# Altium project BB8_BMS.PrjPcb (part 2 of 2)

## Sheet USB_UART.SchDoc
size A
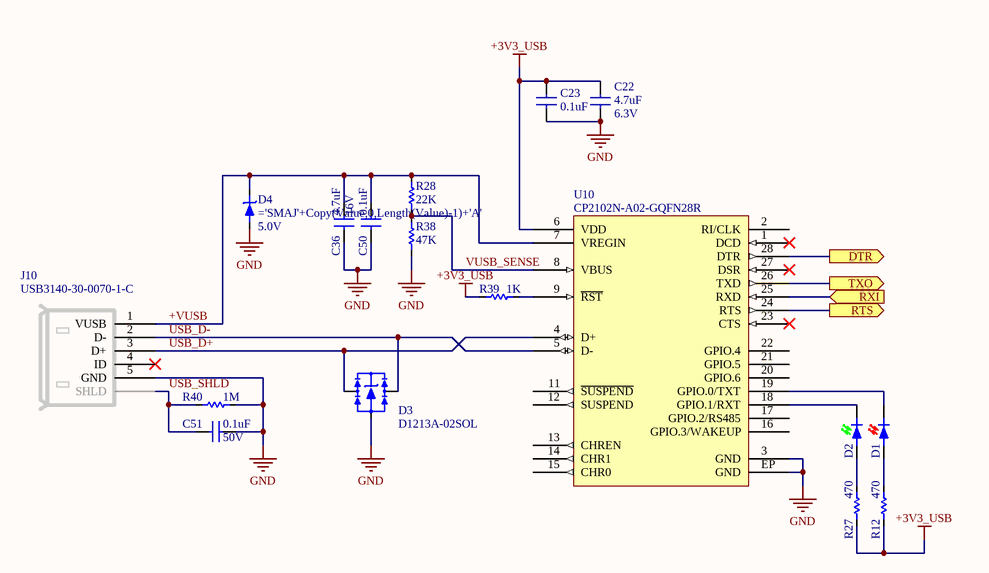
[diagram p11: USB_UART.SchDoc]

### Parts
C22  value 4.7uF  Voltage: 6.3V  [0603_Capacitor]  (hidden comment: CAP 4.7uF 6.3V X5R)
C23  value 0.1uF  [0402_CAPACITOR]  (hidden comment: CAP 0.1uF 16V X7R)
C36  value 4.7uF  Voltage: 16V  [0805_Capacitor]  (hidden comment: CAP 4.7uF 16V X5R)
C50  value 0.1uF  [0402_CAPACITOR]  (hidden comment: CAP 0.1uF 16V X7R)
C51  value 0.1uF  Voltage: 50V  [0603_CAPACITOR]  (hidden comment: CAP 0.1uF 50V X7R)
D1  LTST-C194KRKT  [0603_LED_Red]  (value not drawn)
D2  LTST-C194KGKT  [0603_LED_Green]  (value not drawn)
D3  D1213A-02SOL  [SOT23-3]
D4  value 5.0V  [SMA]  (hidden comment: TVS Diode)
J10  USB3140-30-0070-1-C  [J_USB3140-30-0070-1-C]
R12  value 470  [0402_Resistor]  (hidden comment: R_0402_470_1%)
R27  value 470  [0402_Resistor]  (hidden comment: R_0402_470_1%)
R28  value 22K  [0402_Resistor]  (hidden comment: R_0402_22K_1%)
R38  value 47K  [0402_Resistor]  (hidden comment: R_0402_47K_1%)
R39  value 1K  [0402_Resistor]  (hidden comment: R_0402_1K_1%)
R40  value 1M  [0603_Resistor]  (hidden comment: R_0603_1M_1%)
U10  CP2102N-A02-GQFN28R  [QFN-28-EP_5x5mm]

### Ports
DTR (out), RTS (out), RXI (in), TXO (out)

### Nets
+3V3_USB: C22.2 C23.1 R12.2 R27.2 R39.1 U10.6(VDD)
GND: C22.1 C23.2 C36.1 C50.2 C51.1 D3.3 D4.1(Anode) J10.5(GND) R38.1 R40.2 U10.3(GND) U10.EP(GND)
+VUSB: C36.2 C50.1 D4.2(Cathode) J10.1(VUSB) R28.2 U10.7(VREGIN)
DTR: U10.28(DTR) ; port DTR
RTS: U10.24(RTS) ; port RTS
RXI: U10.25(RXD) ; port RXI
TXO: U10.26(TXD) ; port TXO
USB_D+: D3.1 J10.3(D+) U10.4(D+)
USB_D-: D3.2 J10.2(D-) U10.5(D-)
USB_SHLD: C51.2 J10.SHLD R40.1
VUSB_SENSE: R28.1 R38.2 U10.8(VBUS)
NetD1_1: D1.1(Anode) R12.1
NetD1_2: D1.2(Cathode) U10.19(GPIO.0/TXT)
NetD2_1: D2.1(Anode) R27.1
NetD2_2: D2.2(Cathode) U10.18(GPIO.1/RXT)
NetR39_2: R39.2 U10.9(~{RST})

Not connected (* = marked no-connect by the designer): J10 4(ID)*; U10 1(DCD)* 2(RI/CLK) 11(~{SUSPEND}) 12(SUSPEND) 13(CHREN) 14(CHR1) 15(CHR0) 16(GPIO.3/WAKEUP) 17(GPIO.2/RS485) 20(GPIO.6) 21(GPIO.5) 22(GPIO.4) 23(CTS)* 27(DSR)*

### Library data of the parts
C22 = C_0603_4.7uF_6.3V_10%: CAP CER 4.7UF 6.3V X5R 0603; Package: =SelectedPackage; Temperature Coefficient: X5R; Supplier 1: Digi-Key; Supplier Part Number 1: 1276-1045-1-ND
C23 C50 = C_0402_0.1uF_16V_10%: CAP CERM 0.1uF 10% 16V 0402; Package: =SelectedPackage; Voltage: 16V; Temperature Coefficient: X7R; Supplier 1: Digi-Key; Supplier Part Number 1: 1276-1001-1-ND; Supplier 2: Digi-Key; Supplier Part Number 2: 587-1451-1-ND
C36 = C_0805_4.7uF_16V_10%: CAP CERM 4.7uF 10% 16V 0805; SVP Creator: Spencer Berglund; Package: =SelectedPackage; Temperature Coefficient: X5R; Supplier 1: Digi-Key; Supplier Part Number 1: 1276-1065-6-ND
C51 = C_0603_0.1uF_50V_10%: CAP CERM 0.1uF 10% 50V 0603; SVP Creator: Spencer Berglund; Package: =SelectedPackage; Temperature Coefficient: X7R; Supplier 1: Digi-Key; Supplier Part Number 1: 1276-1000-1-ND
D1 = D_LED_0603_Red: Red 631nm LED Indication - Discrete 2V 0603 (1608 Metric); Manufacturer: Vishay Lite-On; Lens Transparency: Clear; Lens Colour: Colorless; Reverse Voltage: 5V; Forward Current: 5mA; Power Dissipation: 75mW; Luminous Intensity: 95.6mcd; Test Current: 20mA; Viewing Angle: 130°; Value: Red; Manufacturer Part Number: LTST-C194KRKT; Min Operating Temperature: -30°C; Forward Voltage: 2V; Max Operating Temperature: 85°C; Dominant Wavelength: 631nm; Supplier 1: Digi-Key; Supplier Part Number 1: 160-1835-1-ND
D2 = D_LED_0603_Green: Green 572nm LED Indication - Discrete 2.1V 0603 (1608 Metric); Manufacturer: Vishay Lite-On; Lens Transparency: Clear; Lens Colour: Colorless; Reverse Voltage: 5V; Forward Current: 30mA; Power Dissipation: 75mW; Luminous Intensity: 112mcd; Forward Voltage: 2.4V; Test Current: 20mA; Viewing Angle: 130°; Dominant Wavelength: 576.5nm; Value: Green; Manufacturer Part Number: LTST-C194KGKT; Min Operating Temperature: -30°C; Max Operating Temperature: 85°C; Supplier 1: Digi-Key; Supplier Part Number 1: 160-1834-1-ND
D3 = D_D1213A-02SOL: 10V (Typ) Clamp 1A (8/20µs) Ipp Tvs Diode Surface Mount SOT-23 (for USB); Manufacturer: Diodes Incorporated; Type: Steering (Rail to Rail); Voltage - Breakdown (Min): 6V; Capacitance @ Frequency: 0.85pF @ 1MHz; Voltage - Reverse Standoff (Typ): 3.3V; Manufacturer Part Number: D1213A-02SOL; Voltage - Clamping (Max) @ Ipp: 10V (Typ); Current - Peak Pulse (10/1000µs): 1A (8/20µs); Operating Temperature: -40°C ~ 85°C (TA)
D4 = D_TVS_SMAJ_Uni_generic: SMA Unidirectional TVS Diode; Manufacturer: Vishay; Power - Peak Pulse: 400W; Type: Zener; Operating Temperature: -55°C ~ 150°C; HelpURL: http://www.vishay.com/docs/88392/smbj.pdf; Manufacturer PN: ='SMAJ'+Copy(Value,0,Length(Value)-1)+'A'
J10 = J_USB3140-30-0070-1-C: USB - micro B USB 2.0 Receptacle Connector 5 Position Surface Mount, Through Hole; Supplier 1: Digi-Key; Supplier Part Number 1: 2073-USB3140-30-0070-1-CCT-ND
R12 R27 R28 R38 R39 = R_0402_generic_1%: Generic 0402 Resistor (10.2R to 10M); Manufacturer: Yageo; Power Rating: 0.0625W; Temperature Coefficient: ±100ppm/°C; Tolerance: ±1%; Voltage Rating: 50V; Operating Temperature: -55°C ~ 155°C; Manufacturer Part Number: ='RC0402FR-07'+ValueFormatted+'L'; HelpURL: https://www.digikey.com/products/en/resistors/chip-resistor-surface-mount/52?pv17=103&FV=fffc000d%2Cc0001%2C1c0002%2C1f140000%2Cffe00034&k=RC0402; ValueFormatted: =Copy(Copy(Value, 0, Pos('.', Value)-1)+Copy(Value, Length(Value), 1)+Copy(Value, Pos('.', Value)+1, Length(Value)-Pos('.', Value)-1),1,Pos('.',Value)*Length(Value))+Copy(Value,1,Length(Value)*(1-Pos('.',Value)))
R40 = R_0603_generic_1%: Generic 0603 Resistor (10.2R to 10M); Manufacturer: Yageo; Power Rating: 0.1W; Temperature Coefficient: ±100ppm/°C; Tolerance: ±1%; Voltage Rating: 75V; Operating Temperature: -55°C ~ 155°C; Manufacturer Part Number: ='RC0603FR-07'+ValueFormatted+'L'; HelpURL: https://www.digikey.com/products/en/resistors/chip-resistor-surface-mount/52?pv17=103&FV=fffc000d%2Cc0001%2C1c0002%2C1f140000%2Cffe00034&k=RC0603; ValueFormatted: =Copy(Copy(Value, 0, Pos('.', Value)-1)+Copy(Value, Length(Value), 1)+Copy(Value, Pos('.', Value)+1, Length(Value)-Pos('.', Value)-1),1,Pos('.',Value)*Length(Value))+Copy(Value,1,Length(Value)*(1-Pos('.',Value)))
U10 = U_CP2102N-A02-GQFN28R: USB Bridge, USB to UART USB 2.0 UART Interface 28-QFN (5x5); Supplier 1: Digi-Key; Supplier 2: Mouser; Supplier Part Number 1: 336-5890-1-ND; Supplier Part Number 2: 634-CP2102NA02QFN28R

## Sheet CAN.SchDoc
size A
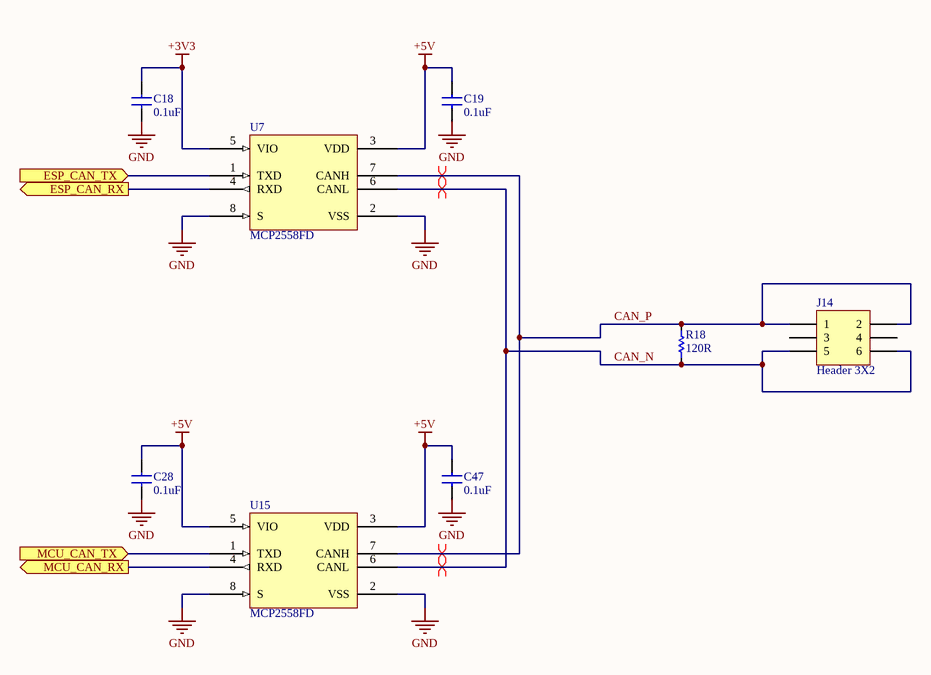
[diagram p12: CAN.SchDoc]

### Parts
C18  value 0.1uF  [0402_CAPACITOR]  (hidden comment: CAP 0.1uF 16V X7R)
C19  value 0.1uF  [0402_CAPACITOR]  (hidden comment: CAP 0.1uF 16V X7R)
C28  value 0.1uF  [0402_CAPACITOR]  (hidden comment: CAP 0.1uF 16V X7R)
C47  value 0.1uF  [0402_CAPACITOR]  (hidden comment: CAP 0.1uF 16V X7R)
J14  Header 3X2  [HDR2X3]
R18  value 120R  [0805_Resistor]  (hidden comment: R_0805_120R_1%)
U7  MCP2558FD  [SOIC-8]
U15  MCP2558FD  [SOIC-8]

### Ports
ESP_CAN_RX (out), ESP_CAN_TX (in), MCU_CAN_RX (out), MCU_CAN_TX (in)

### Nets
+3V3: C18.2 U7.5(VIO)
+5V: C19.2 C28.2 C47.2 U7.3(VDD) U15.3(VDD) U15.5(VIO)
GND: C18.1 C19.1 C28.1 C47.1 U7.2(VSS) U7.8(S) U15.2(VSS) U15.8(S)
CAN_N: J14.5 J14.6 R18.1 U7.6(CANL) U15.6(CANL)
CAN_P: J14.1 J14.2 R18.2 U7.7(CANH) U15.7(CANH)
ESP_CAN_RX: U7.4(RXD) ; port ESP_CAN_RX
ESP_CAN_TX: U7.1(TXD) ; port ESP_CAN_TX
MCU_CAN_RX: U15.4(RXD) ; port MCU_CAN_RX
MCU_CAN_TX: U15.1(TXD) ; port MCU_CAN_TX

Not connected (* = marked no-connect by the designer): J14 3 4

### Layout directives
differential pair: CAN_N, CAN_P

### Library data of the parts
C18 C19 C28 C47 = C_0402_0.1uF_16V_10%: CAP CERM 0.1uF 10% 16V 0402; Package: =SelectedPackage; Voltage: 16V; Temperature Coefficient: X7R; Supplier 1: Digi-Key; Supplier Part Number 1: 1276-1001-1-ND; Supplier 2: Digi-Key; Supplier Part Number 2: 587-1451-1-ND
J14 = Header 3X2: Header, 3-Pin, Dual row; LatestRevisionDate: 17-Jul-2002; LatestRevisionNote: Re-released for DXP Platform.; Publisher: Altium Limited
R18 = R_0805_generic_1%: Generic 0805 resistor (10.2R to 10M); Manufacturer: Yageo; Power Rating: 0.125W; Temperature Coefficient: ±100ppm/°C; Tolerance: ±1%; Voltage Rating: 150V; Operating Temperature: -55°C ~ 155°C; Manufacturer Part Number: ='RC0805FR-07'+ValueFormatted+'L'; HelpURL: https://www.digikey.com/products/en/resistors/chip-resistor-surface-mount/52?pv17=103&FV=fffc000d%2Cc0001%2C1c0002%2C1f140000%2Cffe00034&k=RC0805; ValueFormatted: =Copy(Copy(Value, 0, Pos('.', Value)-1)+Copy(Value, Length(Value), 1)+Copy(Value, Pos('.', Value)+1, Length(Value)-Pos('.', Value)-1),1,Pos('.',Value)*Length(Value))+Copy(Value,1,Length(Value)*(1-Pos('.',Value)))
U7 U15 = U_MCP2558FD: 1/1 Transceiver CANbus 8-SOIC; Manufacturer: Microchip; Manufacturer Part Number: MCP2558FD-H/SN; Receiver Hysteresis: 200mV; Supplier 1: Digi-Key; Supplier Part Number 1: MCP2558FD-H/SN-ND; Min Operating Temperature: -40°C; Max Operating Temperature: 150°C

## Sheet Audio.SchDoc
size A
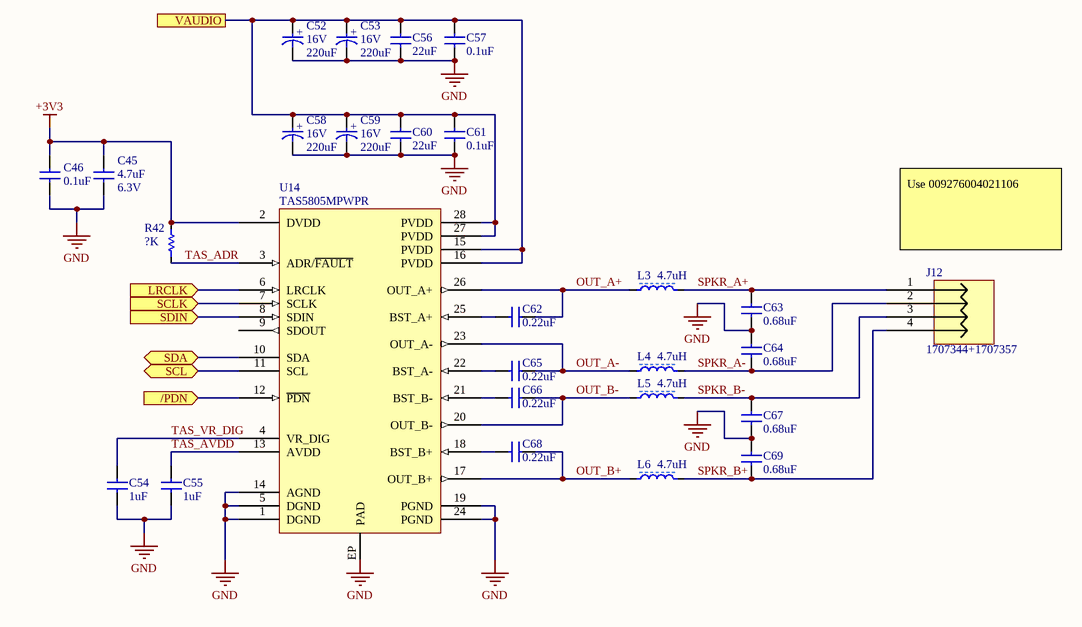
[diagram p13: Audio.SchDoc]

### Parts
C45  value 4.7uF  Voltage: 6.3V  [0603_Capacitor]  (hidden comment: CAP 4.7uF 6.3V X5R)
C46  value 0.1uF  [0402_CAPACITOR]  (hidden comment: CAP 0.1uF 16V X7R)
C52  value 220uF  Voltage Rating: 16V  [CAP_6.3x8mm_SMD]  (hidden comment: APXG160ARA221MF80G)
C53  value 220uF  Voltage Rating: 16V  [CAP_6.3x8mm_SMD]  (hidden comment: APXG160ARA221MF80G)
C54  value 1uF  [0603_CAPACITOR]  (hidden comment: CAP 1uF 16V X7R)
C55  value 1uF  [0603_CAPACITOR]  (hidden comment: CAP 1uF 16V X7R)
C56  value 22uF  [0805_Capacitor]  (hidden comment: CAP 22uF 16V X5R)
C57  value 0.1uF  [0603_CAPACITOR]  (hidden comment: CAP 0.1uF 50V X7R)
C58  value 220uF  Voltage Rating: 16V  [CAP_6.3x8mm_SMD]  (hidden comment: APXG160ARA221MF80G)
C59  value 220uF  Voltage Rating: 16V  [CAP_6.3x8mm_SMD]  (hidden comment: APXG160ARA221MF80G)
C60  value 22uF  [0805_Capacitor]  (hidden comment: CAP 22uF 16V X5R)
C61  value 0.1uF  [0603_CAPACITOR]  (hidden comment: CAP 0.1uF 50V X7R)
C62  value 0.22uF  [0603_CAPACITOR]  (hidden comment: CAP 0.22uF 25V X7R)
C63  value 0.68uF  [0805_Capacitor]  (hidden comment: CAP 0.68uF 25V X7R)
C64  value 0.68uF  [0805_Capacitor]  (hidden comment: CAP 0.68uF 25V X7R)
C65  value 0.22uF  [0603_CAPACITOR]  (hidden comment: CAP 0.22uF 25V X7R)
C66  value 0.22uF  [0603_CAPACITOR]  (hidden comment: CAP 0.22uF 25V X7R)
C67  value 0.68uF  [0805_Capacitor]  (hidden comment: CAP 0.68uF 25V X7R)
C68  value 0.22uF  [0603_CAPACITOR]  (hidden comment: CAP 0.22uF 25V X7R)
C69  value 0.68uF  [0805_Capacitor]  (hidden comment: CAP 0.68uF 25V X7R)
J12  1707344+1707357  [1707344(3)+1707357(1)]
L3  value 4.7uH  [L_SRN6045]  (hidden comment: SRN6045TA-4R7M)
L4  value 4.7uH  [L_SRN6045]  (hidden comment: SRN6045TA-4R7M)
L5  value 4.7uH  [L_SRN6045]  (hidden comment: SRN6045TA-4R7M)
L6  value 4.7uH  [L_SRN6045]  (hidden comment: SRN6045TA-4R7M)
R42  value ?K  [0402_Resistor]  (hidden comment: R_0402_?K_1%)
U14  TAS5805MPWPR  [TSSOP-28-EP]

### Ports
/PDN (in), LRCLK (in), SCL (bidir), SCLK (in), SDA (bidir), SDIN (in), VAUDIO

### Nets
+3V3: C45.2 C46.1 R42.2 U14.2(DVDD)
GND: C45.1 C46.2 C52.2 C53.2 C54.2 C55.2 C56.2 C57.2 C58.2 C59.2 C60.2 C61.2 C63.2 C64.1 C67.2 C69.1 U14.1(DGND) U14.5(DGND) U14.14(AGND) U14.19(PGND) U14.24(PGND) U14.EP(PAD)
/BOOT: U14.12(~{PDN}) ; port /PDN
I2S_LRCLK: U14.6(LRCLK) ; port LRCLK
I2S_SCLK: U14.7(SCLK) ; port SCLK
I2S_SDIN: U14.8(SDIN) ; port SDIN
OUT_A+: C62.1 L3.1 U14.26(OUT_A+)
OUT_A-: C65.1 L4.1 U14.23(OUT_A-)
OUT_B+: C68.1 L6.1 U14.17(OUT_B+)
OUT_B-: C66.1 L5.1 U14.20(OUT_B-)
PMON/IMU_SCL: U14.11(SCL) ; port SCL
PMON/IMU_SDA: U14.10(SDA) ; port SDA
SPKR_A+: C63.1 J12.1 L3.2
SPKR_A-: C64.2 J12.2 L4.2
SPKR_B+: C69.2 J12.4 L6.2
SPKR_B-: C67.1 J12.3 L5.2
TAS_ADR: R42.1 U14.3(ADR/~{FAULT})
TAS_AVDD: C55.1 U14.13(AVDD)
TAS_VR_DIG: C54.1 U14.4(VR_DIG)
VBUS: C52.1 C53.1 C56.1 C57.1 C58.1 C59.1 C60.1 C61.1 U14.15(PVDD) U14.16(PVDD) U14.27(PVDD) U14.28(PVDD) ; port VAUDIO
NetC62_2: C62.2 U14.25(BST_A+)
NetC65_2: C65.2 U14.22(BST_A-)
NetC66_2: C66.2 U14.21(BST_B-)
NetC68_2: C68.2 U14.18(BST_B+)

Not connected (* = marked no-connect by the designer): U14 9(SDOUT)

### Notes on the sheet
- (near J12) Use 009276004021106
- (in symbol C_APXG160ARA221MF80G) +

### Library data of the parts
C45 = C_0603_4.7uF_6.3V_10%: CAP CER 4.7UF 6.3V X5R 0603; Package: =SelectedPackage; Temperature Coefficient: X5R; Supplier 1: Digi-Key; Supplier Part Number 1: 1276-1045-1-ND
C46 = C_0402_0.1uF_16V_10%: CAP CERM 0.1uF 10% 16V 0402; Package: =SelectedPackage; Voltage: 16V; Temperature Coefficient: X7R; Supplier 1: Digi-Key; Supplier Part Number 1: 1276-1001-1-ND; Supplier 2: Digi-Key; Supplier Part Number 2: 587-1451-1-ND
C52 C53 C58 C59 = C_APXG160ARA221MF80G: 220µF 16V Aluminum Polymer Capacitor Radial, Can - SMD 22 mOhm 15000 Hrs @ 105°C; Manufacturer: United Chemi-Con; ESR (Equivalent Series Resistance): 22mR; Life (Hours): 15000Hour; Tolerance: 20%; Ripple Current: 3.3A; Supplier 1: Digi-Key; Supplier Part Number 1: 565-4283-6-ND; Manufacturer Part Number: APXG160ARA221MF80G; Min Operating Temperature: -55°C; Max Operating Temperature: 105°C
C54 C55 = C_0603_1uF_16V_10%: CAP CERM 1uF 10% 16V 0603; SVP Creator: Spencer Berglund; Package: =SelectedPackage; Voltage: 16V; Temperature Coefficient: X7R; Supplier 1: Digi-Key; Supplier Part Number 1: 1276-6524-6-ND
C56 C60 = C_0805_22uF_16V_20%: CAP CERM 22uF 20% 16V 0805; Package: =SelectedPackage; Voltage: 16V; Temperature Coefficient: X5R; Supplier 1: Digi-Key; Supplier Part Number 1: 1276-6780-6-ND
C57 C61 = C_0603_0.1uF_50V_10%: as C51 on sheet USB_UART; Package: =SelectedPackage; Voltage: 50V; Temperature Coefficient: X7R; Supplier 1: Digi-Key; Supplier Part Number 1: 1276-1000-1-ND
C62 C65 C66 C68 = C_0603_0.22uF_25V_10%: CAP CER 0.22UF 25V X7R 0603; Package: =SelectedPackage; Voltage: 25V; Temperature Coefficient: X7R; Supplier 1: Arrow; Supplier 2: Digi-Key; Supplier Part Number 1: CL10B224KA8NNNC; Supplier Part Number 2: 1276-1111-1-ND
C63 C64 C67 C69 = C_0805_0.68uF_25V_10%: CAP CERM 0.68uF 10% 25V 0805; Package: =SelectedPackage; Voltage: 25V; Temperature Coefficient: X7R; Supplier 1: Digi-Key; Supplier 2: Mouser; Supplier Part Number 1: 311-3386-1-ND; Supplier Part Number 2: 603-CC805KKX7R8BB684
J12 = J_PHOENIX_4T_3.81: PCB terminal block ZFKDS 3.81mm vertical, 4 pin; Supplier 1: Digi-Key; Supplier Part Number 1: 277-6731-ND; Supplier 2: Digi-Key; Supplier Part Number 2: 1707357-ND
L3-L6 = L_SRN6045TA-4R7M: 4.7µH Semi-Shielded Wirewound Inductor 4.5A 26mOhm Nonstandard; Manufacturer: Bourns; Inductance Tolerance: 20%; Saturation Current: 6.8A; DC Resistance (DCR): 26mR; RMS Current (Irms): 4.5A; Manufacturer Part Number: SRN6045TA-4R7M; Supplier 1: Digi-Key; Supplier Part Number 1: SRN6045TA-4R7MCT-ND
R42 = R_0402_generic_1%: as R12 on sheet USB_UART; Operating Temperature: -55°C ~ 155°C; Manufacturer Part Number: ='RC0402FR-07'+ValueFormatted+'L'; HelpURL: https://www.digikey.com/products/en/resistors/chip-resistor-surface-mount/52?pv17=103&FV=fffc000d%2Cc0001%2C1c0002%2C1f140000%2Cffe00034&k=RC0402; ValueFormatted: =Copy(Copy(Value, 0, Pos('.', Value)-1)+Copy(Value, Length(Value), 1)+Copy(Value, Pos('.', Value)+1, Length(Value)-Pos('.', Value)-1),1,Pos('.',Value)*Length(Value))+Copy(Value,1,Length(Value)*(1-Pos('.',Value)))
U14 = U_TAS5805M: Amplifier IC 1-Channel (Mono) or 2-Channel (Stereo) Class D 28-HTSSOP; Manufacturer: Texas Instruments; Supplier 1: Digi-Key; Supplier 2: Arrow; Supplier Part Number 1: 296-51627-1-ND; Supplier Part Number 2: TAS5805MPWPR; Manufacturer Part Number: TAS5805MPWPR

## Sheet PWM_Channel.SchDoc
size A
Used 4 times, as channels U_PWM_Channel1, U_PWM_Channel2, U_PWM_Channel3, U_PWM_Channel4. Parts and nets are listed once, with the designators drawn on the sheet.
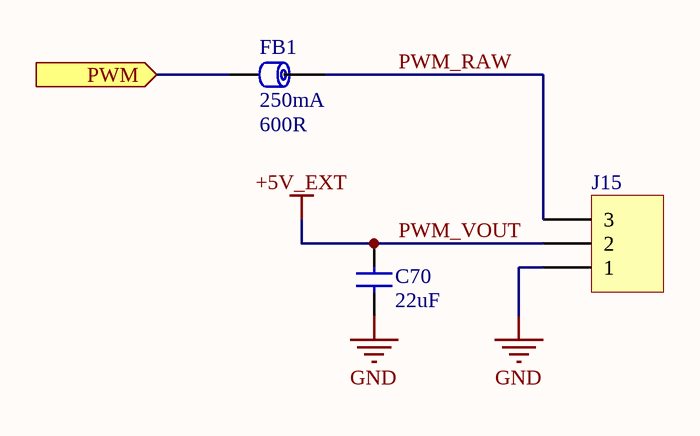
[diagram p14: PWM_Channel.SchDoc]

### Parts
C70  value 22uF  [0805_Capacitor]  (hidden comment: CAP 22uF 16V X5R)
FB1  value 600R  Current Rating: 250mA  [0402_Inductor]  (hidden comment: BK1005HM601-T)
J15  Header 3  [HDR1X3]  (value not drawn)

### Ports
PWM (in)

### Nets
+5V_EXT: C70.1 J15.2  [also labelled PWM_VOUT]
GND: C70.2 J15.1
PWM: FB1.1 ; port PWM
PWM_RAW: FB1.2 J15.3

### Channels
U_PWM_Channel1: designators end in A; ports PWM=PWM
U_PWM_Channel2: designators end in B; ports PWM=PWM
U_PWM_Channel3: designators end in C; ports PWM=PWM
U_PWM_Channel4: designators end in D; ports PWM=PWM

### Library data of the parts
C70 = C_0805_22uF_16V_20%: CAP CERM 22uF 20% 16V 0805; Package: =SelectedPackage; Voltage: 16V; Temperature Coefficient: X5R; Supplier 1: Digi-Key; Supplier Part Number 1: 1276-6780-6-ND
FB1 = FB_0402_600R_250mA: 600 Ohms @ 100MHz 1 Ferrite Bead 0402 (1005 Metric) 250mA 500mOhm; Manufacturer: Taiyo Yuden; DC Resistance (DCR): 500mR; Frequency: 100MHz; Supplier 1: Digi-Key; Supplier Part Number 1: 490-9702-1-ND; Manufacturer Part Number: BK1005HM601-T; Max Operating Temperature: 125°C; Min Operating Temperature: -55°C
J15 = Header 3: Header, 3-Pin; LatestRevisionDate: 17-Jul-2002; LatestRevisionNote: Re-released for DXP Platform.; Publisher: Altium Limited

## Sheet WS281x.SchDoc
size A
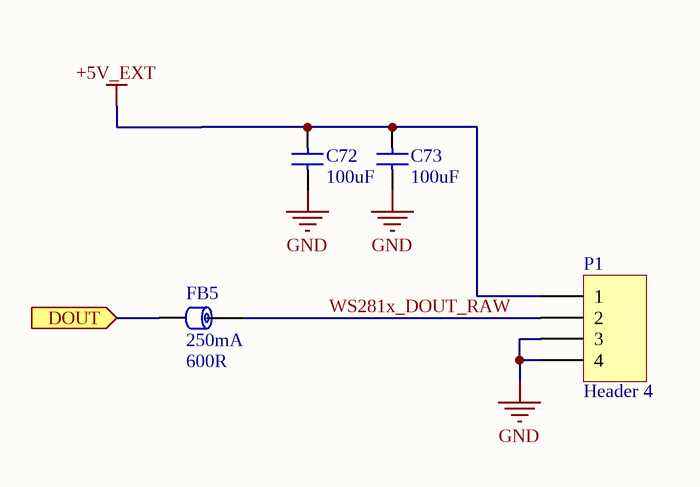
[diagram p15: WS281x.SchDoc]

### Parts
C72  value 100uF  [1210_Capacitor]  (hidden comment: C3225X5R0J107M250AC)
C73  value 100uF  [1210_Capacitor]  (hidden comment: C3225X5R0J107M250AC)
FB5  value 600R  Current Rating: 250mA  [0402_Inductor]  (hidden comment: BK1005HM601-T)
P1  Header 4  [HDR1X4]

### Ports
DOUT (in)

### Nets
+5V_EXT: C72.1 C73.1 P1.1
GND: C72.2 C73.2 P1.3 P1.4
DOUT: FB5.1 ; port DOUT
WS281x_DOUT_RAW: FB5.2 P1.2

### Library data of the parts
C72 C73 = C_1210_100uF_6.3V_20%: CAP CER 100UF 6.3V 20% X5R 1210; SVP Creator: Spencer Berglund; Package: 1210; Supplier 1: Digi-Key; Supplier Part Number 1: 445-1437-1-ND
FB5 = FB_0402_600R_250mA: as FB1 on sheet PWM_Channel; Frequency: 100MHz; Supplier 1: Digi-Key; Supplier Part Number 1: 490-9702-1-ND; Manufacturer Part Number: BK1005HM601-T; Max Operating Temperature: 125°C; Min Operating Temperature: -55°C
P1 = Header 4: Header, 4-Pin; LatestRevisionDate: 17-Jul-2002; LatestRevisionNote: Re-released for DXP Platform.; Publisher: Altium Limited

## Sheet Micro.SchDoc
size B
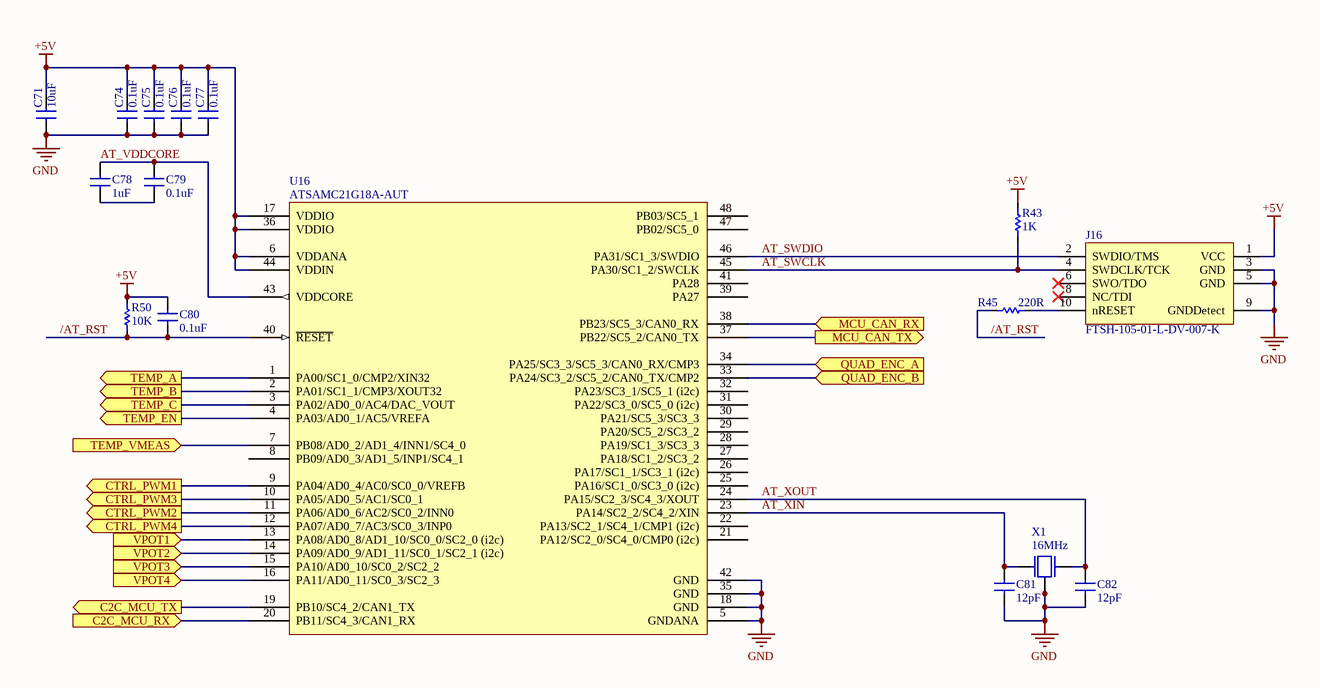
[diagram p16: Micro.SchDoc]

### Parts
C71  value 10uF  [0603_Capacitor]  (hidden comment: CAP 10uF 6.3V X5R)
C74  value 0.1uF  [0402_CAPACITOR]  (hidden comment: CAP 0.1uF 16V X7R)
C75  value 0.1uF  [0402_CAPACITOR]  (hidden comment: CAP 0.1uF 16V X7R)
C76  value 0.1uF  [0402_CAPACITOR]  (hidden comment: CAP 0.1uF 16V X7R)
C77  value 0.1uF  [0402_CAPACITOR]  (hidden comment: CAP 0.1uF 16V X7R)
C78  value 1uF  [0603_CAPACITOR]  (hidden comment: CAP 1uF 16V X7R)
C79  value 0.1uF  [0402_CAPACITOR]  (hidden comment: CAP 0.1uF 16V X7R)
C80  value 0.1uF  [0402_CAPACITOR]  (hidden comment: CAP 0.1uF 16V X7R)
C81  value 12pF  [0402_CAPACITOR]  (hidden comment: C_0402_12pF_C0G/NP0_50V_5%)
C82  value 12pF  [0402_CAPACITOR]  (hidden comment: C_0402_12pF_C0G/NP0_50V_5%)
J16  FTSH-105-01-L-DV-007-K  [J_Cortex_JTAG_SMD]
R43  value 1K  [0402_Resistor]  (hidden comment: R_0402_1K_1%)
R45  value 220R  [0402_Resistor]  (hidden comment: R_0402_220R_1%)
R50  value 10K  [0402_Resistor]  (hidden comment: R_0402_10K_1%)
U16  ATSAMC21G18A-AUT  [TQFP-48]
X1  value 16MHz  [X_TSX-3225]  (hidden comment: TSX-3225_16.0000MF18X)

### Ports
C2C_MCU_RX (in), C2C_MCU_TX (out), CTRL_PWM1 (out), CTRL_PWM2 (out), CTRL_PWM3 (out), CTRL_PWM4 (out), MCU_CAN_RX (in), MCU_CAN_TX (out), QUAD_ENC_A (in), QUAD_ENC_B (in), TEMP_A (out), TEMP_B (out), TEMP_C (out), TEMP_EN (out), TEMP_VMEAS (in), VPOT1 (in), VPOT2 (in), VPOT3 (in), VPOT4 (in)

### Nets
+5V: C71.1 C74.1 C75.1 C76.1 C77.1 C80.1 J16.1(VCC) R43.1 R50.1 U16.6(VDDANA) U16.17(VDDIO) U16.36(VDDIO) U16.44(VDDIN)
GND: C71.2 C74.2 C75.2 C76.2 C77.2 C81.2 C82.2 J16.3(GND) J16.5(GND) J16.9(GNDDetect) U16.5(GNDANA) U16.18(GND) U16.35(GND) U16.42(GND) X1.2 X1.4
/AT_RST: C80.2 R45.1 R50.2 U16.40(~{RESET})
A: U16.1(PA00/SC1_0/CMP2/XIN32) ; port TEMP_A
AT_SWCLK: J16.4(SWDCLK/TCK) R43.2 U16.45(PA30/SC1_2/SWCLK)
AT_SWDIO: J16.2(SWDIO/TMS) U16.46(PA31/SC1_3/SWDIO)
AT_VDDCORE: C78.2 C79.2 U16.43(VDDCORE)
AT_XIN: C81.1 U16.23(PA14/SC2_2/SC4_2/XIN) X1.1
AT_XOUT: C82.1 U16.24(PA15/SC2_3/SC4_3/XOUT) X1.3
B: U16.2(PA01/SC1_1/CMP3/XOUT32) ; port TEMP_B
C: U16.3(PA02/AD0_0/AC4/DAC_VOUT) ; port TEMP_C
C2C_ESP_RX: U16.19(PB10/SC4_2/CAN1_TX) ; port C2C_MCU_TX
C2C_ESP_TX: U16.20(PB11/SC4_3/CAN1_RX) ; port C2C_MCU_RX
EN: U16.4(PA03/AD0_1/AC5/VREFA) ; port TEMP_EN
MCU_CAN_RX: U16.38(PB23/SC5_3/CAN0_RX) ; port MCU_CAN_RX
MCU_CAN_TX: U16.37(PB22/SC5_2/CAN0_TX) ; port MCU_CAN_TX
OUT: U16.7(PB08/AD0_2/AD1_4/INN1/SC4_0) ; port TEMP_VMEAS
PWM1: U16.9(PA04/AD0_4/AC0/SC0_0/VREFB) ; port CTRL_PWM1
PWM2: U16.11(PA06/AD0_6/AC2/SC0_2/INN0) ; port CTRL_PWM2
PWM3: U16.10(PA05/AD0_5/AC1/SC0_1) ; port CTRL_PWM3
PWM4: U16.12(PA07/AD0_7/AC3/SC0_3/INP0) ; port CTRL_PWM4
QUAD_ENC_A: U16.34(PA25/SC3_3/SC5_3/CAN0_RX/CMP3) ; port QUAD_ENC_A
QUAD_ENC_B: U16.33(PA24/SC3_2/SC5_2/CAN0_TX/CMP2) ; port QUAD_ENC_B
VPOT1: U16.13(PA08/AD0_8/AD1_10/SC0_0/SC2_0_(i2c)) ; port VPOT1
VPOT2: U16.14(PA09/AD0_9/AD1_11/SC0_1/SC2_1_(i2c)) ; port VPOT2
VPOT3: U16.15(PA10/AD0_10/SC0_2/SC2_2) ; port VPOT3
VPOT4: U16.16(PA11/AD0_11/SC0_3/SC2_3) ; port VPOT4
NetC78_1: C78.1 C79.1
NetJ16_10: J16.10(nRESET) R45.2

Not connected (* = marked no-connect by the designer): J16 6(SWO/TDO)* 8(NC/TDI)*; U16 8(PB09/AD0_3/AD1_5/INP1/SC4_1) 21(PA12/SC2_0/SC4_0/CMP0_(i2c)) 22(PA13/SC2_1/SC4_1/CMP1_(i2c)) 25(PA16/SC1_0/SC3_0_(i2c)) 26(PA17/SC1_1/SC3_1_(i2c)) 27(PA18/SC1_2/SC3_2) 28(PA19/SC1_3/SC3_3) 29(PA20/SC5_2/SC3_2) 30(PA21/SC5_3/SC3_3) 31(PA22/SC3_0/SC5_0_(i2c)) 32(PA23/SC3_1/SC5_1_(i2c)) 39(PA27) 41(PA28) 47(PB02/SC5_0) 48(PB03/SC5_1)

### Library data of the parts
C71 = C_0603_10uF_6.3V_20%: CAP CER 10UF 6.3V X5R 0603; Package: =SelectedPackage; Voltage: 6.3V; Temperature Coefficient: X5R; Supplier 1: Digi-Key; Supplier Part Number 1: 1276-1119-1-ND
C74-C77 C79 C80 = C_0402_0.1uF_16V_10%: CAP CERM 0.1uF 10% 16V 0402; Package: =SelectedPackage; Voltage: 16V; Temperature Coefficient: X7R; Supplier 1: Digi-Key; Supplier Part Number 1: 1276-1001-1-ND; Supplier 2: Digi-Key; Supplier Part Number 2: 587-1451-1-ND
C78 = C_0603_1uF_16V_10%: as C54 on sheet Audio; Package: =SelectedPackage; Voltage: 16V; Temperature Coefficient: X7R; Supplier 1: Digi-Key; Supplier Part Number 1: 1276-6524-6-ND
C81 C82 = C_0402_generic_C0G/NP0_50V_5%: Generic 0402 C0G/NP0 50V 5% ceramic capacitor / Valid values range from 10pF to 1000pF with E24 selection (1.0, 1.1, 1.2, 1.3, 1.5, 1.6, 1.8, 2.0, 2.2, 2.4, 2.7, 3.0, 3.3, 3.6, 3.9, 4.3, 4.7, 5.1, 5.6, 6.2, 6.8, 7.5, 8.2, 9.1), although E12 are more common; Manufacturer: Samsung; Temperature Coefficient: C0G, NP0; Package: =SelectedPackage; Voltage: 50V; ValueFormatted: =Copy(Value,0,2)+Copy('012',Pos('p',Value)-2,1); Manufacturer Part Number: ='CL05C'+ValueFormatted+'JB5NNNC'; HelpURL: https://www.digikey.com/products/en/capacitors/ceramic-capacitors/60?k=&pkeyword=&sv=0&pv405=19&sf=0&FV=fffc04fc%2Cc0002%2Cc0003%2C1c0002%2C380020%2C400004%2C440012%2C3f00019%2C1f140000%2Cffe0003c%2Cmu1000pF%7C2049%2Cmu100pF%7C2049%2Cmu10pF%7C2049%2Cmu11pF%7C2049%2Cmu120pF%7C2049%2Cmu12pF%7C2049%2Cmu13pF%7C2049%2Cmu150pF%7C2049%2Cmu15pF%7C2049%2Cmu16pF%7C2049%2Cmu180pF%7C2049%2Cmu18pF%7C2049%2Cmu200pF%7C2049%2Cmu20pF%7C2049%2Cmu220pF%7C2049%2Cmu22pF%7C2049%2Cmu24pF%7C2049%2Cmu270pF%7C2049%2Cmu27pF%7C2049%2Cmu30pF%7C2049%2Cmu330pF%7C2049%2Cmu33pF%7C2049%2Cmu36pF%7C2049%2Cmu390pF%7C2049%2Cmu39pF%7C2049%2Cmu470pF%7C2049%2Cmu47pF%7C2049%2Cmu51pF%7C2049%2Cmu560pF%7C2049%2Cmu56pF%7C2049%2Cmu62pF%7C2049%2Cmu680pF%7C2049%2Cmu68pF%7C2049%2Cmu75pF%7C2049%2Cmu820pF%7C2049%2Cmu82pF%7C2049%2Cmu91pF%7C2049&ColumnSort=2049
J16 = J_Cortex_JTAG_SMD: CORTEX JTAG DEBUG CONNECTOR; Manufacturer: Samtec Inc; Manufacturer PN: FTSH-105-01-L-DV-007-K; Supplier 1: Digi-Key; Supplier Part Number 1: SAM9438-ND
R43 R45 R50 = R_0402_generic_1%: as R12 on sheet USB_UART; Operating Temperature: -55°C ~ 155°C; Manufacturer Part Number: ='RC0402FR-07'+ValueFormatted+'L'; HelpURL: https://www.digikey.com/products/en/resistors/chip-resistor-surface-mount/52?pv17=103&FV=fffc000d%2Cc0001%2C1c0002%2C1f140000%2Cffe00034&k=RC0402; ValueFormatted: =Copy(Copy(Value, 0, Pos('.', Value)-1)+Copy(Value, Length(Value), 1)+Copy(Value, Pos('.', Value)+1, Length(Value)-Pos('.', Value)-1),1,Pos('.',Value)*Length(Value))+Copy(Value,1,Length(Value)*(1-Pos('.',Value)))
U16 = U_ATSAMC21G18A-AUT: ARM® Cortex®-M0+ SAM C21 Microcontroller IC 32-Bit 48MHz 256KB (256K x 8) FLASH 48-TQFP (7x7); Supplier 1: Digi-Key; Supplier Part Number 1: ATSAMC21G18A-AUTCT-ND
X1 = X_TSX-3225_16.0000MF18X: 16MHz ±10ppm Crystal 9pF 60 Ohms 4-SMD, No Lead; Manufacturer: Epson; Manufacturer Part Number: TSX-322516.0000MF18X-AC3; Frequency Stability: 18ppm; ESR (Equivalent Series Resistance): 60R; Supplier 1: Digi-Key; Supplier Part Number 1: SER3636CT-ND; Load Capacitance: 9pF; Frequency Tolerance: 10ppm; Max Operating Temperature: 85°C; Min Operating Temperature: -40°C

## Nets that join several sheets
+3V3: Wifi (8 pins), Power_Regulation (5 pins), 3V3_Regulator (C27.1 L2.2 R22.2 U4.6), IMU (5 pins), CAN (C18.2 U7.5), Audio (C45.2 C46.1 R42.2 U14.2)
+3V3_BQ: Batt_Meas (C5.1 U1.8), 3V3_Regulator (U4.3)
+5V: Wifi (C20.2 C25.2 U5.5 U9.5), Power_Regulation (D7.2 F6.1 R21.2 U11.9), Temp_Mux (C31.1 C32.1 U8.16 U13.5), CAN (6 pins), Micro (13 pins)
+5V_EXT: Power_Regulation (F6.2), U_PWM_Channel1 (C70A.1 J15A.2), U_PWM_Channel2 (C70B.1 J15B.2), U_PWM_Channel3 (C70C.1 J15C.2), U_PWM_Channel4 (C70D.1 J15D.2), WS281x (C72.1 C73.1 P1.1)
GND: Batt_Meas (6 pins), Power_Control (6 pins), Wifi (21 pins), Power_Distribution (6 pins), Power_Regulation (8 pins), 3V3_Regulator (6 pins), Ext_Regulators (15 pins), Temp_Meas (12 pins), Temp_Mux (6 pins), IMU (7 pins), USB_UART (12 pins), CAN (8 pins), Audio (22 pins), U_PWM_Channel1 (C70A.2 J15A.1), U_PWM_Channel2 (C70B.2 J15B.1), U_PWM_Channel3 (C70C.2 J15C.1), U_PWM_Channel4 (C70D.2 J15D.1), WS281x (C72.2 C73.2 P1.3 P1.4), Micro (16 pins)
5V_EN: Wifi (U2.27), Power_Regulation (R25.2), Ext_Regulators (U6.19)
5V_EXT_VOUT: Power_Regulation (R21.1 U11.10), Ext_Regulators (7 pins)
/BOOT: Wifi (6 pins), Audio (U14.12)
A: Temp_Mux (U8.11), Micro (U16.1)
Alert: Batt_Meas (R5.2 U1.20), Wifi (U2.10)
B: Temp_Mux (U8.10), Micro (U16.2)
C: Temp_Mux (U8.9), Micro (U16.3)
C2C_ESP_RX: Wifi (R19.1), Micro (U16.19)
C2C_ESP_TX: Wifi (U9.4), Micro (U16.20)
CHARGE_EN: Batt_Meas (U1.2), Power_Control (U3.4)
DISCHARGE_EN: Batt_Meas (U1.1), Power_Control (U3.6)
DOUT: Wifi (U5.4), WS281x (FB5.1)
DTR: Wifi (Q4.1 Q5.2 R41.2), USB_UART (U10.28)
EN: Temp_Mux (U8.6), Micro (U16.4)
ESP_CAN_RX: Wifi (U2.7), CAN (U7.4)
ESP_CAN_TX: Wifi (U2.8), CAN (U7.1)
I2S_LRCLK: Wifi (U2.30), Audio (U14.6)
I2S_SCLK: Wifi (U2.33), Audio (U14.7)
I2S_SDIN: Wifi (U2.31), Audio (U14.8)
IMU_INT1: Wifi (U2.5), IMU (U12.4)
MCU_CAN_RX: CAN (U15.4), Micro (U16.38)
MCU_CAN_TX: CAN (U15.1), Micro (U16.37)
OUT: Temp_Mux (U13.1 U13.4), Micro (U16.7)
PMON/IMU_SCL: Wifi (R20.2 U2.36), Power_Regulation (U11.4), IMU (U12.13), Audio (U14.11)
PMON/IMU_SDA: Wifi (R10.2 U2.37), Power_Regulation (U11.5), IMU (U12.14), Audio (U14.10)
PRECHARGE_EN: Power_Control (U3.8), Wifi (U2.9)
PWM: U_PWM_Channel1 (FB1A.1), U_PWM_Channel2 (FB1B.1), U_PWM_Channel3 (FB1C.1), U_PWM_Channel4 (FB1D.1)
RTS: Wifi (Q4.2 Q5.1 R41.1), USB_UART (U10.24)
RXI: Wifi (U2.35), USB_UART (U10.25)
SCL: Batt_Meas (R4.2 U1.5), Wifi (U2.12)
SDA: Batt_Meas (R6.2 U1.4), Wifi (U2.11)
T0: Temp_Meas (J8.1), Temp_Mux (U8.13)
T1: Temp_Meas (J8.3), Temp_Mux (U8.14)
T2: Temp_Meas (J8.5), Temp_Mux (U8.15)
T3: Temp_Meas (J8.7), Temp_Mux (U8.12)
T4: Temp_Meas (J9.1), Temp_Mux (U8.1)
T5: Temp_Meas (J9.3), Temp_Mux (U8.5)
T6: Temp_Meas (J9.5), Temp_Mux (U8.2)
T7: Temp_Meas (J9.7), Temp_Mux (U8.4)
TXO: Wifi (U2.34), USB_UART (U10.26)
VBAT: Batt_Meas (9 pins), Power_Control (8 pins), Power_Regulation (R30.1 U11.14)
VBUS: Power_Control (9 pins), Power_Distribution (6 pins), Power_Regulation (R33.1 U11.8), Audio (12 pins)
VIN: Power_Regulation (R30.2 U11.13), 3V3_Regulator (C26.1 U4.2)
VIN_5V: Power_Regulation (R33.2 U11.7), Ext_Regulators (6 pins)